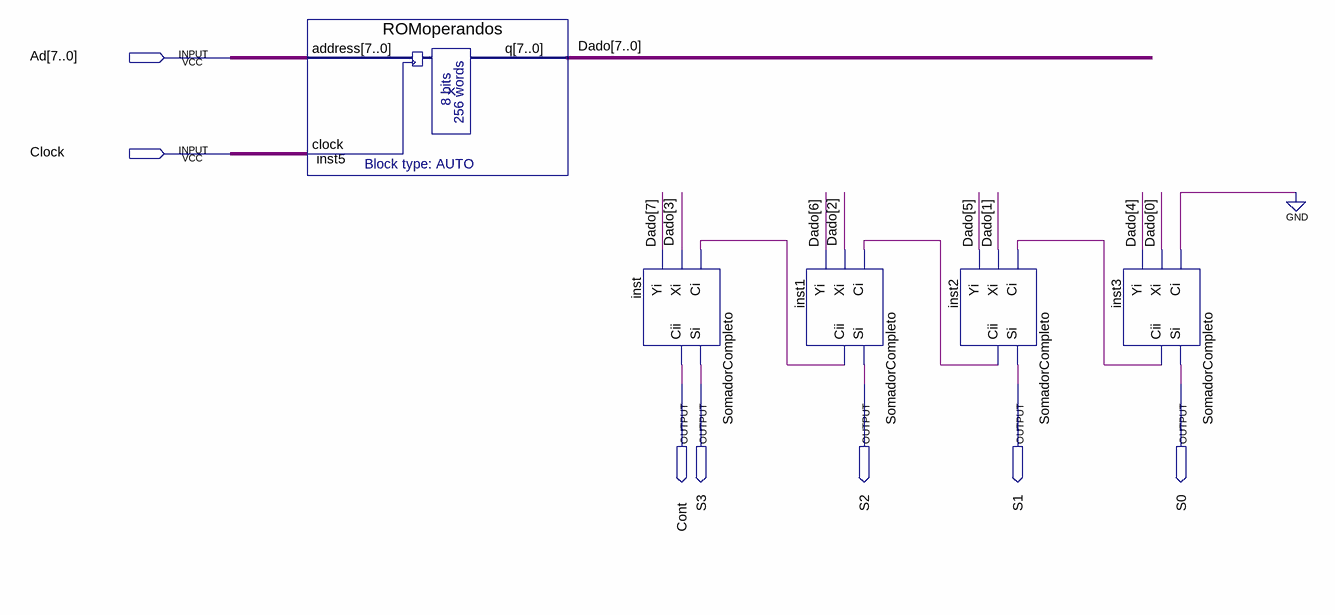
[diagram p0: schematic sheet]
// Quartus schematic Somador4bits.bdf as structural Verilog: 5 symbols, 7 pins
module Somador4bits (
  input  [7:0] Ad,
  input  Clock,
  output Cont,
  output S3,
  output S2,
  output S1,
  output S0
);

  wire inst1_cii, inst2_cii, inst3_cii;
  wire [7:0] Dado;

  ROMoperandos inst5 (.address(Ad), .clock(Clock), .q(Dado));
  SomadorCompleto inst (.Ci(inst1_cii), .Xi(Dado[3]), .Yi(Dado[7]), .Si(S3), .Cii(Cont));
  SomadorCompleto inst1 (.Ci(inst2_cii), .Xi(Dado[2]), .Yi(Dado[6]), .Si(S2), .Cii(inst1_cii));
  SomadorCompleto inst2 (.Ci(inst3_cii), .Xi(Dado[1]), .Yi(Dado[5]), .Si(S1), .Cii(inst2_cii));
  SomadorCompleto inst3 (.Ci(1'b0), .Xi(Dado[0]), .Yi(Dado[4]), .Si(S0), .Cii(inst3_cii));
endmodule
